# Altium schematic sheet Bluetooth.SchDoc
size A4; SheetNumber: 2; SheetTotal: 4
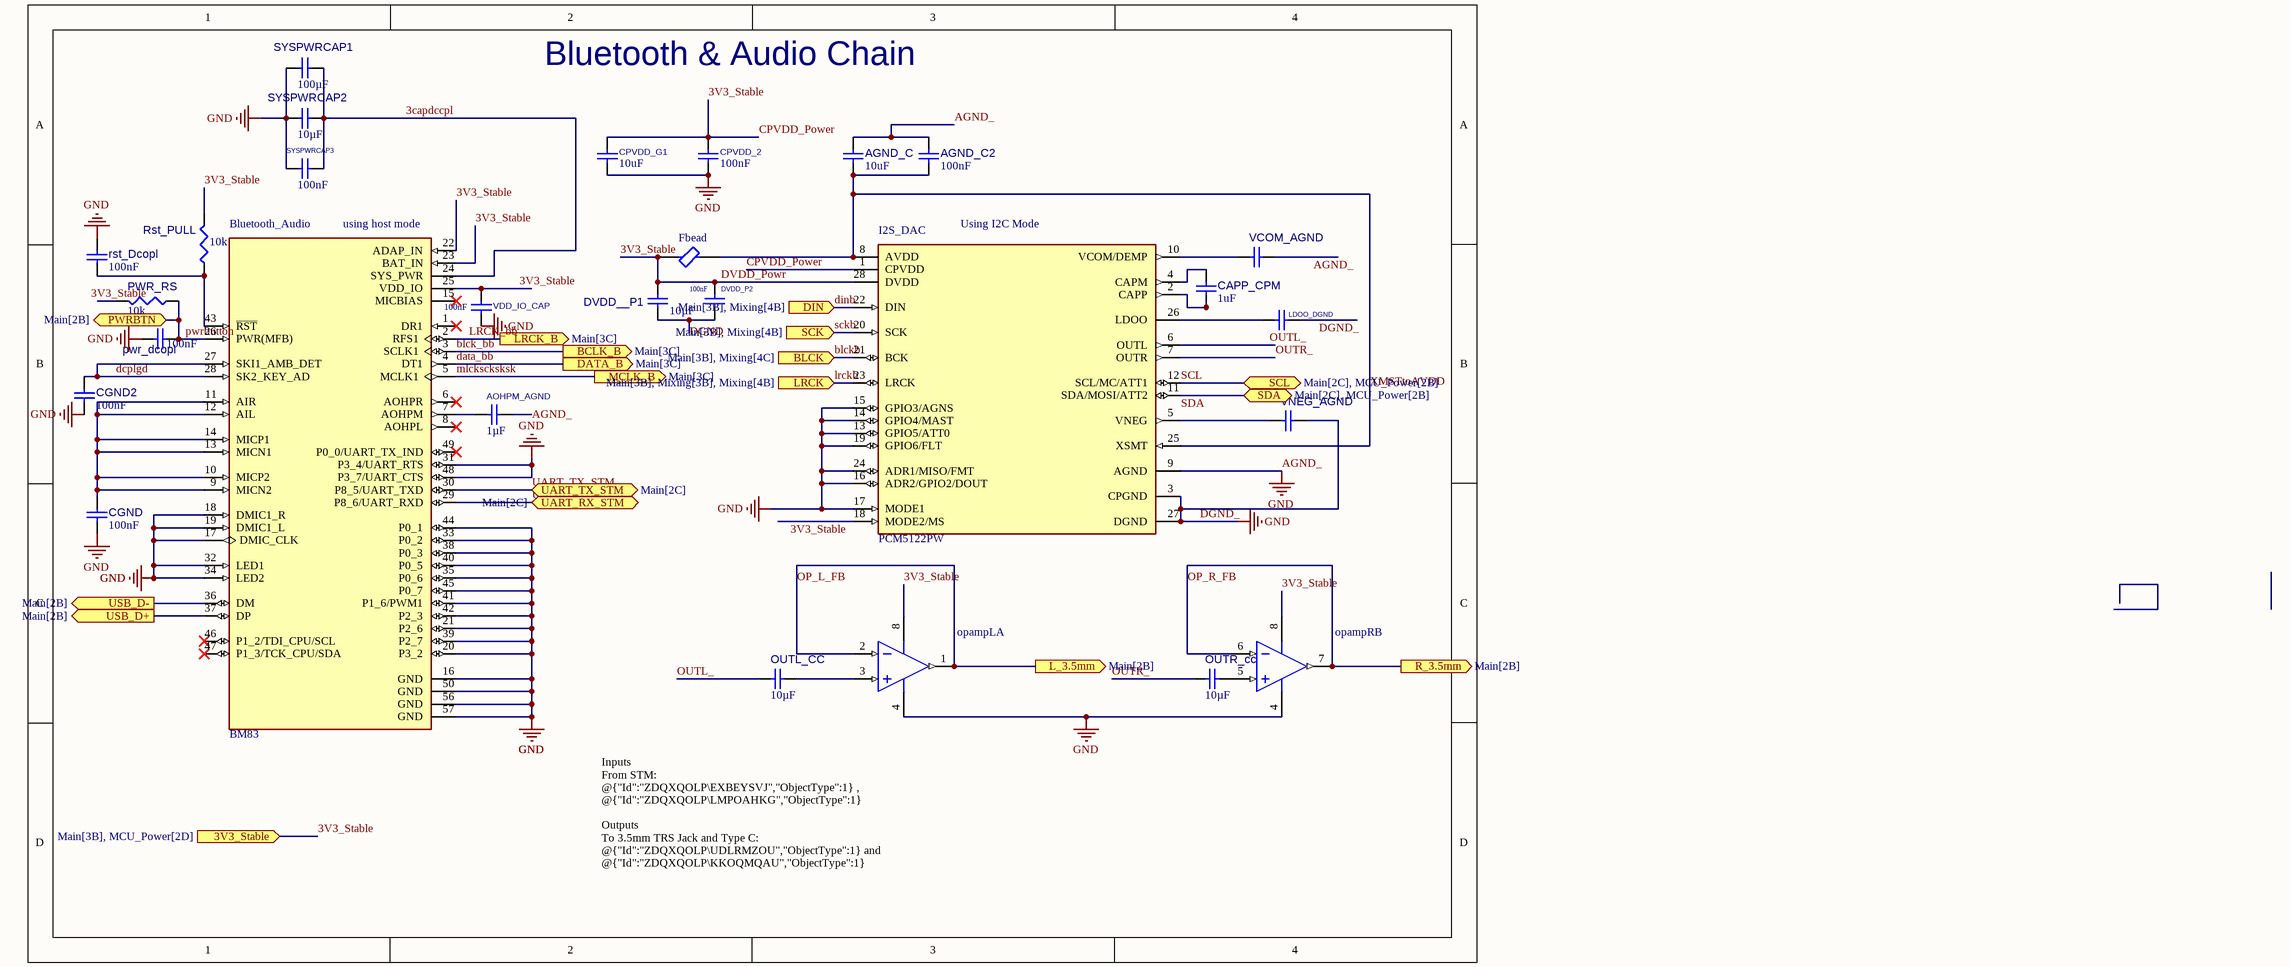
[diagram p0: Bluetooth.SchDoc]

## Parts
AGND_C  value 10uF  [CAPC1005X56X25LL10T15]  (hidden comment: Capacitor 0.1 uF +/- 5% 16 V 0402)
AGND_C2  value 100nF  [CAPC0402(1005)60_L]  (hidden comment: Capacitor 100nF +/-20% 10V 0402)
AOHPM_AGND  value 1µF  [CAPC2013X145X50ML20T25]  (hidden comment: Capacitor 1 uF +/- 10% 25 V 0805)
Bluetooth_Audio  BM83  [XCVR_BM83SM1-00AA]
CAPP_CPM  value 1uF  [CAPC1005X56X25LL10T15]  (hidden comment: Capacitor 0.1 uF +/- 5% 16 V 0402)
CGND  value 100nF  [CAPC0402(1005)60_L]  (hidden comment: Capacitor 100nF +/-20% 10V 0402)
CGND2  value 100nF  [CAPC0402(1005)60_L]  (hidden comment: Capacitor 100nF +/-20% 10V 0402)
CPVDD_2  value 100nF  [CAPC0402(1005)60_L]  (hidden comment: Capacitor 100nF +/-20% 10V 0402)
CPVDD_G1  value 10uF  [CAPC1005X56X25LL10T15]  (hidden comment: Capacitor 0.1 uF +/- 5% 16 V 0402)
DVDD__P1  value 10µF  [CAPC3216X180X50NL20T25]  (hidden comment: Capacitor 10 uF +/- 10% 16 V 1206)
DVDD_P2  value 100nF  [CAPC0402(1005)60_L]  (hidden comment: Capacitor 100nF +/-20% 10V 0402)
Fbead  NFZ32BW3R6HZ10L  [FP-NFZ32BW-w2_8-MFG]  (value not drawn)
I2S_DAC  PCM5122PW  [FP-PW0028A-IPC_C]
LDOO_DGND  Capacitor 0.1 uF +/- 5% 16 V 0402  [CAPC1005X56X25LL10T15]  (value not drawn)
opampL  OPA1612AIDR  [D0008A_N]  (value not drawn)  (part A of 2)
opampR  OPA1612AIDR  [D0008A_N]  (value not drawn)  (part B of 2)
OUTL_CC  value 10µF  [CAPC3216X180X50NL20T25]  (hidden comment: Capacitor 10 uF +/- 10% 16 V 1206)
OUTR_cc  value 10µF  [CAPC3216X180X50NL20T25]  (hidden comment: Capacitor 10 uF +/- 10% 16 V 1206)
pwr_dcopl  value 100nF  [CAPC0402(1005)60_L]  (hidden comment: Capacitor 100nF +/-20% 10V 0402)
PWR_RS  value 10k  [RESC0402(1005)_L]  (hidden comment: 10KR2F)
rst_Dcopl  value 100nF  [CAPC0402(1005)60_L]  (hidden comment: Capacitor 100nF +/-20% 10V 0402)
Rst_PULL  value 10k  [RESC0402(1005)_L]  (hidden comment: 10KR2F)
SYSPWRCAP1  value 100µF  [CAPC0805(2012)145_L]  (hidden comment: Capacitor 100µF +/-20% 6.3V 0805)
SYSPWRCAP2  value 10µF  [CAPC0805(2012)145_L]  (hidden comment: Capacitor 10µF +/-20% 25V 0805)
SYSPWRCAP3  value 100nF  [CAPC0402(1005)60_L]  (hidden comment: Capacitor 100nF +/-20% 50V 0402)
VCOM_AGND  Capacitor 0.1 uF +/- 5% 16 V 0402  [CAPC1005X56X25LL10T15]  (value not drawn)
VDD_IO_CAP  value 100nF  [CAPC0402(1005)60_L]  (hidden comment: Capacitor 100nF +/-20% 25V 0402)
VNEG_AGND  Capacitor 0.1 uF +/- 5% 16 V 0402  [CAPC1005X56X25LL10T15]  (value not drawn)

## Ports
3V3_Stable (in, see Main[3B], MCU_Power[2D]), BCLK_B (out, see Main[3C]), BLCK (in, see Main[3B], Mixing[4C]), DATA_B (out, see Main[3C]), DIN (in, see Main[3B], Mixing[4B]), L_3.5mm (out, see Main[2B]), LRCK (in, see Main[3B], Mixing[3B], Mixing[4B]), LRCK_B (out, see Main[3C]), MCLK_B (out, see Main[3C]), PWRBTN (bidir, see Main[2B]), R_3.5mm (out, see Main[2B]), SCK (in, see Main[3B], Mixing[4B]), SCL (bidir, see Main[2C], MCU_Power[2B]), SDA (bidir, see Main[2C], MCU_Power[2B]), UART_RX_STM (bidir, see Main[2C]), UART_TX_STM (bidir, see Main[2C]), USB_D+ (out, see Main[2B]), USB_D- (out, see Main[2B])

## Nets
AGND_: AGND_C.2 AGND_C2.1 AOHPM_AGND.2 Bluetooth_Audio.16(GND) Bluetooth_Audio.17(DMIC_CLK) Bluetooth_Audio.18(DMIC1_R) Bluetooth_Audio.19(DMIC1_L) Bluetooth_Audio.20(P3_2) Bluetooth_Audio.21(P2_6) Bluetooth_Audio.31(P3_4/UART_RTS) Bluetooth_Audio.32(LED1) Bluetooth_Audio.33(P0_2) Bluetooth_Audio.34(LED2) Bluetooth_Audio.35(P0_6) Bluetooth_Audio.38(P0_3) Bluetooth_Audio.39(P2_7) Bluetooth_Audio.40(P0_5) Bluetooth_Audio.41(P1_6/PWM1) Bluetooth_Audio.42(P2_3) Bluetooth_Audio.44(P0_1) Bluetooth_Audio.45(P0_7) Bluetooth_Audio.48(P3_7/UART_CTS) Bluetooth_Audio.50(GND) Bluetooth_Audio.56(GND) Bluetooth_Audio.57(GND) CGND.1 CGND2.1 CPVDD_2.1 CPVDD_G1.2 I2S_DAC.3(CPGND) I2S_DAC.9(AGND) I2S_DAC.13(GPIO5/ATT0) I2S_DAC.14(GPIO4/MAST) I2S_DAC.15(GPIO3/AGNS) I2S_DAC.16(ADR2/GPIO2/DOUT) I2S_DAC.17(MODE1) I2S_DAC.19(GPIO6/FLT) I2S_DAC.24(ADR1/MISO/FMT) I2S_DAC.27(DGND) LDOO_DGND.2 opampL.4(V-) opampR.4(V-) pwr_dcopl.1 rst_Dcopl.1 SYSPWRCAP1.1 SYSPWRCAP2.1 SYSPWRCAP3.1 VCOM_AGND.2 VDD_IO_CAP.1 VNEG_AGND.2  [also labelled DGND_, GND]
3capdccpl: Bluetooth_Audio.24(SYS_PWR) SYSPWRCAP1.2 SYSPWRCAP2.2 SYSPWRCAP3.2
3V3_Stable: Bluetooth_Audio.22(ADAP_IN) Bluetooth_Audio.23(BAT_IN) Bluetooth_Audio.25(VDD_IO) CPVDD_2.2 CPVDD_G1.1 DVDD__P1.2 DVDD_P2.2 Fbead.1 I2S_DAC.1(CPVDD) I2S_DAC.18(MODE2/MS) I2S_DAC.28(DVDD) opampL.8(V+) opampR.8(V+) Rst_PULL.2 VDD_IO_CAP.2 ; port 3V3_Stable  [also labelled CPVDD_Power, DVDD_Powr]
blck_bb: Bluetooth_Audio.3(SCLK1) ; port BCLK_B
blckb: I2S_DAC.21(BCK) ; port BLCK
data_bb: Bluetooth_Audio.4(DT1) ; port DATA_B
dcplgd: Bluetooth_Audio.27(SKI1_AMB_DET) Bluetooth_Audio.28(SK2_KEY_AD) CGND2.2
dinb: I2S_DAC.22(DIN) ; port DIN
LRCK_bb: Bluetooth_Audio.2(RFS1) ; port LRCK_B
lrckb: I2S_DAC.23(LRCK) ; port LRCK
mlckscksksk: Bluetooth_Audio.5(MCLK1) ; port MCLK_B
OP_L_FB: opampL.1(OUT_A) opampL.2(IN_A-) ; port L_3.5mm
OP_R_FB: opampR.6(IN_B-) opampR.7(OUT_B) ; port R_3.5mm
OUTL_: I2S_DAC.6(OUTL) OUTL_CC.1
OUTR_: I2S_DAC.7(OUTR) OUTR_cc.1
pwrbutton: Bluetooth_Audio.26(PWR(MFB)) pwr_dcopl.2 PWR_RS.1 ; port PWRBTN
sckb: I2S_DAC.20(SCK) ; port SCK
SCL: I2S_DAC.12(SCL/MC/ATT1) ; port SCL
SDA: I2S_DAC.11(SDA/MOSI/ATT2) ; port SDA
UART_RX_STM: Bluetooth_Audio.29(P8_6/UART_RXD) ; port UART_RX_STM
UART_TX_STM: Bluetooth_Audio.30(P8_5/UART_TXD) ; port UART_TX_STM
USB_D+: Bluetooth_Audio.37(DP) ; port USB_D+
USB_D-: Bluetooth_Audio.36(DM) ; port USB_D-
XMSTtoAVDD: AGND_C.1 AGND_C2.2 Fbead.2 I2S_DAC.8(AVDD) I2S_DAC.25(XSMT)
NetAOHPM_AGND_1: AOHPM_AGND.1 Bluetooth_Audio.7(AOHPM)
NetBluetooth_Audio_9: Bluetooth_Audio.9(MICN2) Bluetooth_Audio.10(MICP2) Bluetooth_Audio.11(AIR) Bluetooth_Audio.12(AIL) Bluetooth_Audio.13(MICN1) Bluetooth_Audio.14(MICP1) CGND.2
NetBluetooth_Audio_43: Bluetooth_Audio.43(~{RST}) rst_Dcopl.2 Rst_PULL.1
NetCAPP_CPM_1: CAPP_CPM.1 I2S_DAC.2(CAPP)
NetCAPP_CPM_2: CAPP_CPM.2 I2S_DAC.4(CAPM)
NetDVDD__P1_1: DVDD__P1.1 DVDD_P2.1
NetI2S_DAC_5: I2S_DAC.5(VNEG) VNEG_AGND.1
NetI2S_DAC_10: I2S_DAC.10(VCOM/DEMP) VCOM_AGND.1
NetI2S_DAC_26: I2S_DAC.26(LDOO) LDOO_DGND.1
NetopampL_3: opampL.3(IN_A+) OUTL_CC.2
NetopampR_5: opampR.5(IN_B+) OUTR_cc.2

Not connected (* = marked no-connect by the designer): Bluetooth_Audio 1(DR1)* 6(AOHPR)* 8(AOHPL)* 15(MICBIAS)* 46(P1_2/TDI_CPU/SCL)* 47(P1_3/TCK_CPU/SDA)* 49(P0_0/UART_TX_IND)*; PWR_RS 2

## Notes on the sheet
- Bluetooth & Audio Chain
- (near Bluetooth_Audio) using host mode
- (near I2S_DAC) Using I2C Mode
- Inputs
  From STM:
  @{"Id":"ZDQXQOLP\EXBEYSVJ","ObjectType":1} , @{"Id":"ZDQXQOLP\LMPOAHKG","ObjectType":1}
  Outputs
  To 3.5mm TRS Jack and Type C:
  @{"Id":"ZDQXQOLP\UDLRMZOU","ObjectType":1} and @{"Id":"ZDQXQOLP\KKOQMQAU","ObjectType":1}
- Labels drawn without touching a wire or pin: 3V3_Stable, DGND

## Library data of the parts
AGND_C CAPP_CPM CPVDD_G1 = CMP-001-00001-6: Chip Capacitor, 0.1 uF, +/- 5%, 16 V, 0402 (1005 Metric); Capacitor Type: Ceramic; Voltage Rating: 16V; Max Operating Temperature: 125°C; Min Operating Temperature: -55°C; Case/Package: 0402; Mounting Technology: SM; Pins: 2; Tolerance: 5%; RoHS Compliant: True
AGND_C2 CGND CGND2 CPVDD_2 DVDD_P2 pwr_dcopl rst_Dcopl = CMP-001-00061-3: Chip Capacitor, 100nF +/-20%, 10V, 0402, Thickness 0.6 mm; Tolerance: 20%; Mounting Technology: SMT; Voltage Rating: 10V; Max Operating Temperature: 85°C; Pins: 2; Case/Package: 0402; Min Operating Temperature: -55°C
AOHPM_AGND = CMP-001-00010-6: Chip Capacitor, 1 uF, +/-10%, 25 V, 0805 (2012 Metric); Capacitor Type: Ceramic; Voltage Rating: 25V; RoHS Compliant: True; Pins: 2; Mounting Technology: SM; Max Operating Temperature: 125°C; Min Operating Temperature: -55°C; Tolerance: 10%; Case/Package: 0805
Bluetooth_Audio = CMP-017-000000-1: Bluetooth Bluetooth v5.0 Transceiver Module 2.4GHz ~ 2.48GHz PCB Trace Surface Mount; MF: Microchip Technology; MP: BM83SM1-00AA; SnapEDA_Link: https://www.snapeda.com/parts/BM83SM1-00AA/Microchip/view-part/?ref=snap; Package: None; Design Item ID: BM83SM1-00AA; Check_prices: https://www.snapeda.com/parts/BM83SM1-00AA/Microchip/view-part/?ref=eda; Component Type: Standard; Value: *; Pin Count: 52; Source: BM83SM1-00AA.SchLib
DVDD__P1 OUTL_CC OUTR_cc = CMP-001-00016-6: Chip Capacitor, 10 uF, +/- 10%, 16 V, 1206 (3216 Metric); Capacitor Type: Ceramic; Voltage Rating: 16V; Tolerance: 10%; Min Operating Temperature: -55°C; Pins: 2; Mounting Technology: SM; Case/Package: 1206; Max Operating Temperature: 125°C; RoHS Compliant: True
Fbead = CMP-06046-002300-1: Ferrite Bead 3.6Ω @ 1MHz ±30% 2.55A 0.036Ω 1210 Embossed T/R
I2S_DAC = CMP-04861-000026-1: IC DAC 16/24/32BIT 384K 28TSSOP; Resolution: 32b; Operating Supply Current: 15mA; Supply Type: Analog; Output Type: Voltage; Number of Channels: 2; Interface: I2C; Operating Supply Voltage: 3.3V; Sampling Rate: 384KS/s; Signal to Noise Ratio (SNR): 112dB; Max Frequency: 3.072GHz; Polarity: Bipolar; Number of Bits: 32; Max Power Dissipation: 155mW; Output Voltage: 2.1V; Min Supply Voltage: 3V; Max Supply Voltage: 3.6V; Number of Analog Inputs: 0; Mount: Surface Mount; Max Operating Temperature: 85°C; Length: 9.8mm; Width: 4.5mm; RoHS Compliant: Yes; Min Operating Temperature: -25°C; Lead Free: Lead Free; Case/Package: TSSOP; Conversion Rate: 384KS/s; Series: DirectPath™; Packaging: Rail/Tube; Number of Converters: 2; Number of Pins: 28; Height: 1.05mm; REACH SVHC: No SVHC; Output Polarity: Bipolar; Package Quantity: 50; Number of Analog Outputs: 2; Weight: 0.004233oz; Radiation Hardening: No; Number of DAC Channels: 2
LDOO_DGND VCOM_AGND VNEG_AGND = CMP-001-00001-6: Chip Capacitor, 0.1 uF, +/- 5%, 16 V, 0402 (1005 Metric); Capacitor Type: Ceramic; Value: 1uF; Voltage Rating: 16V; Max Operating Temperature: 125°C; Min Operating Temperature: -55°C; Case/Package: 0402; Mounting Technology: SM; Pins: 2; Tolerance: 5%; RoHS Compliant: True
opampL opampR = CMP-0808-00009-2: 1.1 nV/rtHz Noise, Low Power, Precision Operational Amplifier, 4.5 to 36 V, -40 to 85 degC, 8-pin SOIC (D8), Green (RoHS & no Sb/Br); Manufacturer: Texas Instruments; Iq per channel(Max)(mA): 4.5; Vn at Flatband(Typ)(nV/rtHz): 1.1; Vmax(V): 36; Number of Channels: 2; SubFamily: Audio Operational Amplifier; GBW(Typ)(MHz): 40; Code_JEDEC: MS-012; ComponentLink3Description: Package Specification; Eco-Plan: Green (RoHS & no Sb/Br); PackageVersion: 4040047-3/M, 06/2011; PackageReference: D0008A; Mounting Technology: Surface Mount; ComponentLink1URL: http://www.ti.com/; Vmin(V): 4.5; ComponentLink2Description: Datasheet; PartNumber: OPA1612AIDR; ComponentLink1Description: Manufacturer URL; PackageDescription: 8-Pin Plastic Small Outline, Body 4.9 x 3.9 mm, Pitch 1.27 mm; ComponentLink3URL: http://www.ti.com/litv/pdf/msoi002j; DatasheetVersion: SBOS450B; ComponentLink2URL: http://www.ti.com/general/docs/lit/getliterature.tsp?genericPartNumber=OPA1612&fileType=pdf
PWR_RS Rst_PULL = CMP-009-00066-2: 10K 0.063W 1% 0402 (1005 Metric)  SMD; Power: 63mW; Case/Package: 0402; Mounting Technology: SMT; Pins: 2; Tolerance: 1%
SYSPWRCAP1 = CMP-001-00054-4: Chip Capacitor, 100µF +/-20%, 6.3V, 0805, Thickness 1.45 mm; Tolerance: 10%; Min Operating Temperature: -55°C; Max Operating Temperature: 85°C; Pins: 2; Mounting Technology: SMT; Case/Package: 0805; Voltage Rating: 6.3V
SYSPWRCAP2 = CMP-001-00079-4: Chip Capacitor, 10µF +/-20%, 25V, 0805, Thickness 1.45 mm; Tolerance: 10%; Max Operating Temperature: 85°C; Case/Package: 0805; Voltage Rating: 25V; Min Operating Temperature: -55°C; Mounting Technology: SMT; Pins: 2
SYSPWRCAP3 = CMP-001-00067-3: Chip Capacitor, 100nF +/-20%, 50V, 0402, Thickness 0.6 mm; Tolerance: 10%; Min Operating Temperature: -55°C; Pins: 2; Case/Package: 0402; Max Operating Temperature: 85°C; Voltage Rating: 50V; Mounting Technology: SMT
VDD_IO_CAP = CMP-001-00065-4: Chip Capacitor, 100nF +/-20%, 25V, 0402, Thickness 0.6 mm; Tolerance: 10%; Max Operating Temperature: 85°C; Min Operating Temperature: -55°C; Pins: 2; Voltage Rating: 25V; Mounting Technology: SMT; Case/Package: 0402